# EasyEDA Pro project 工程设计_桌面小屏幕.eprj

# Schematic Schematic1
Board Name: Board1; Create Date: 2024-11-13; Page Name: P1; Project Name: 工程设计_桌面小屏幕; Schematic Name: Schematic1; Update Date: 2025-03-07; Company: 西电; Drawed: 赵怀潼; Page Size: A3; Reviewed: 赵怀潼; Version: V0.1
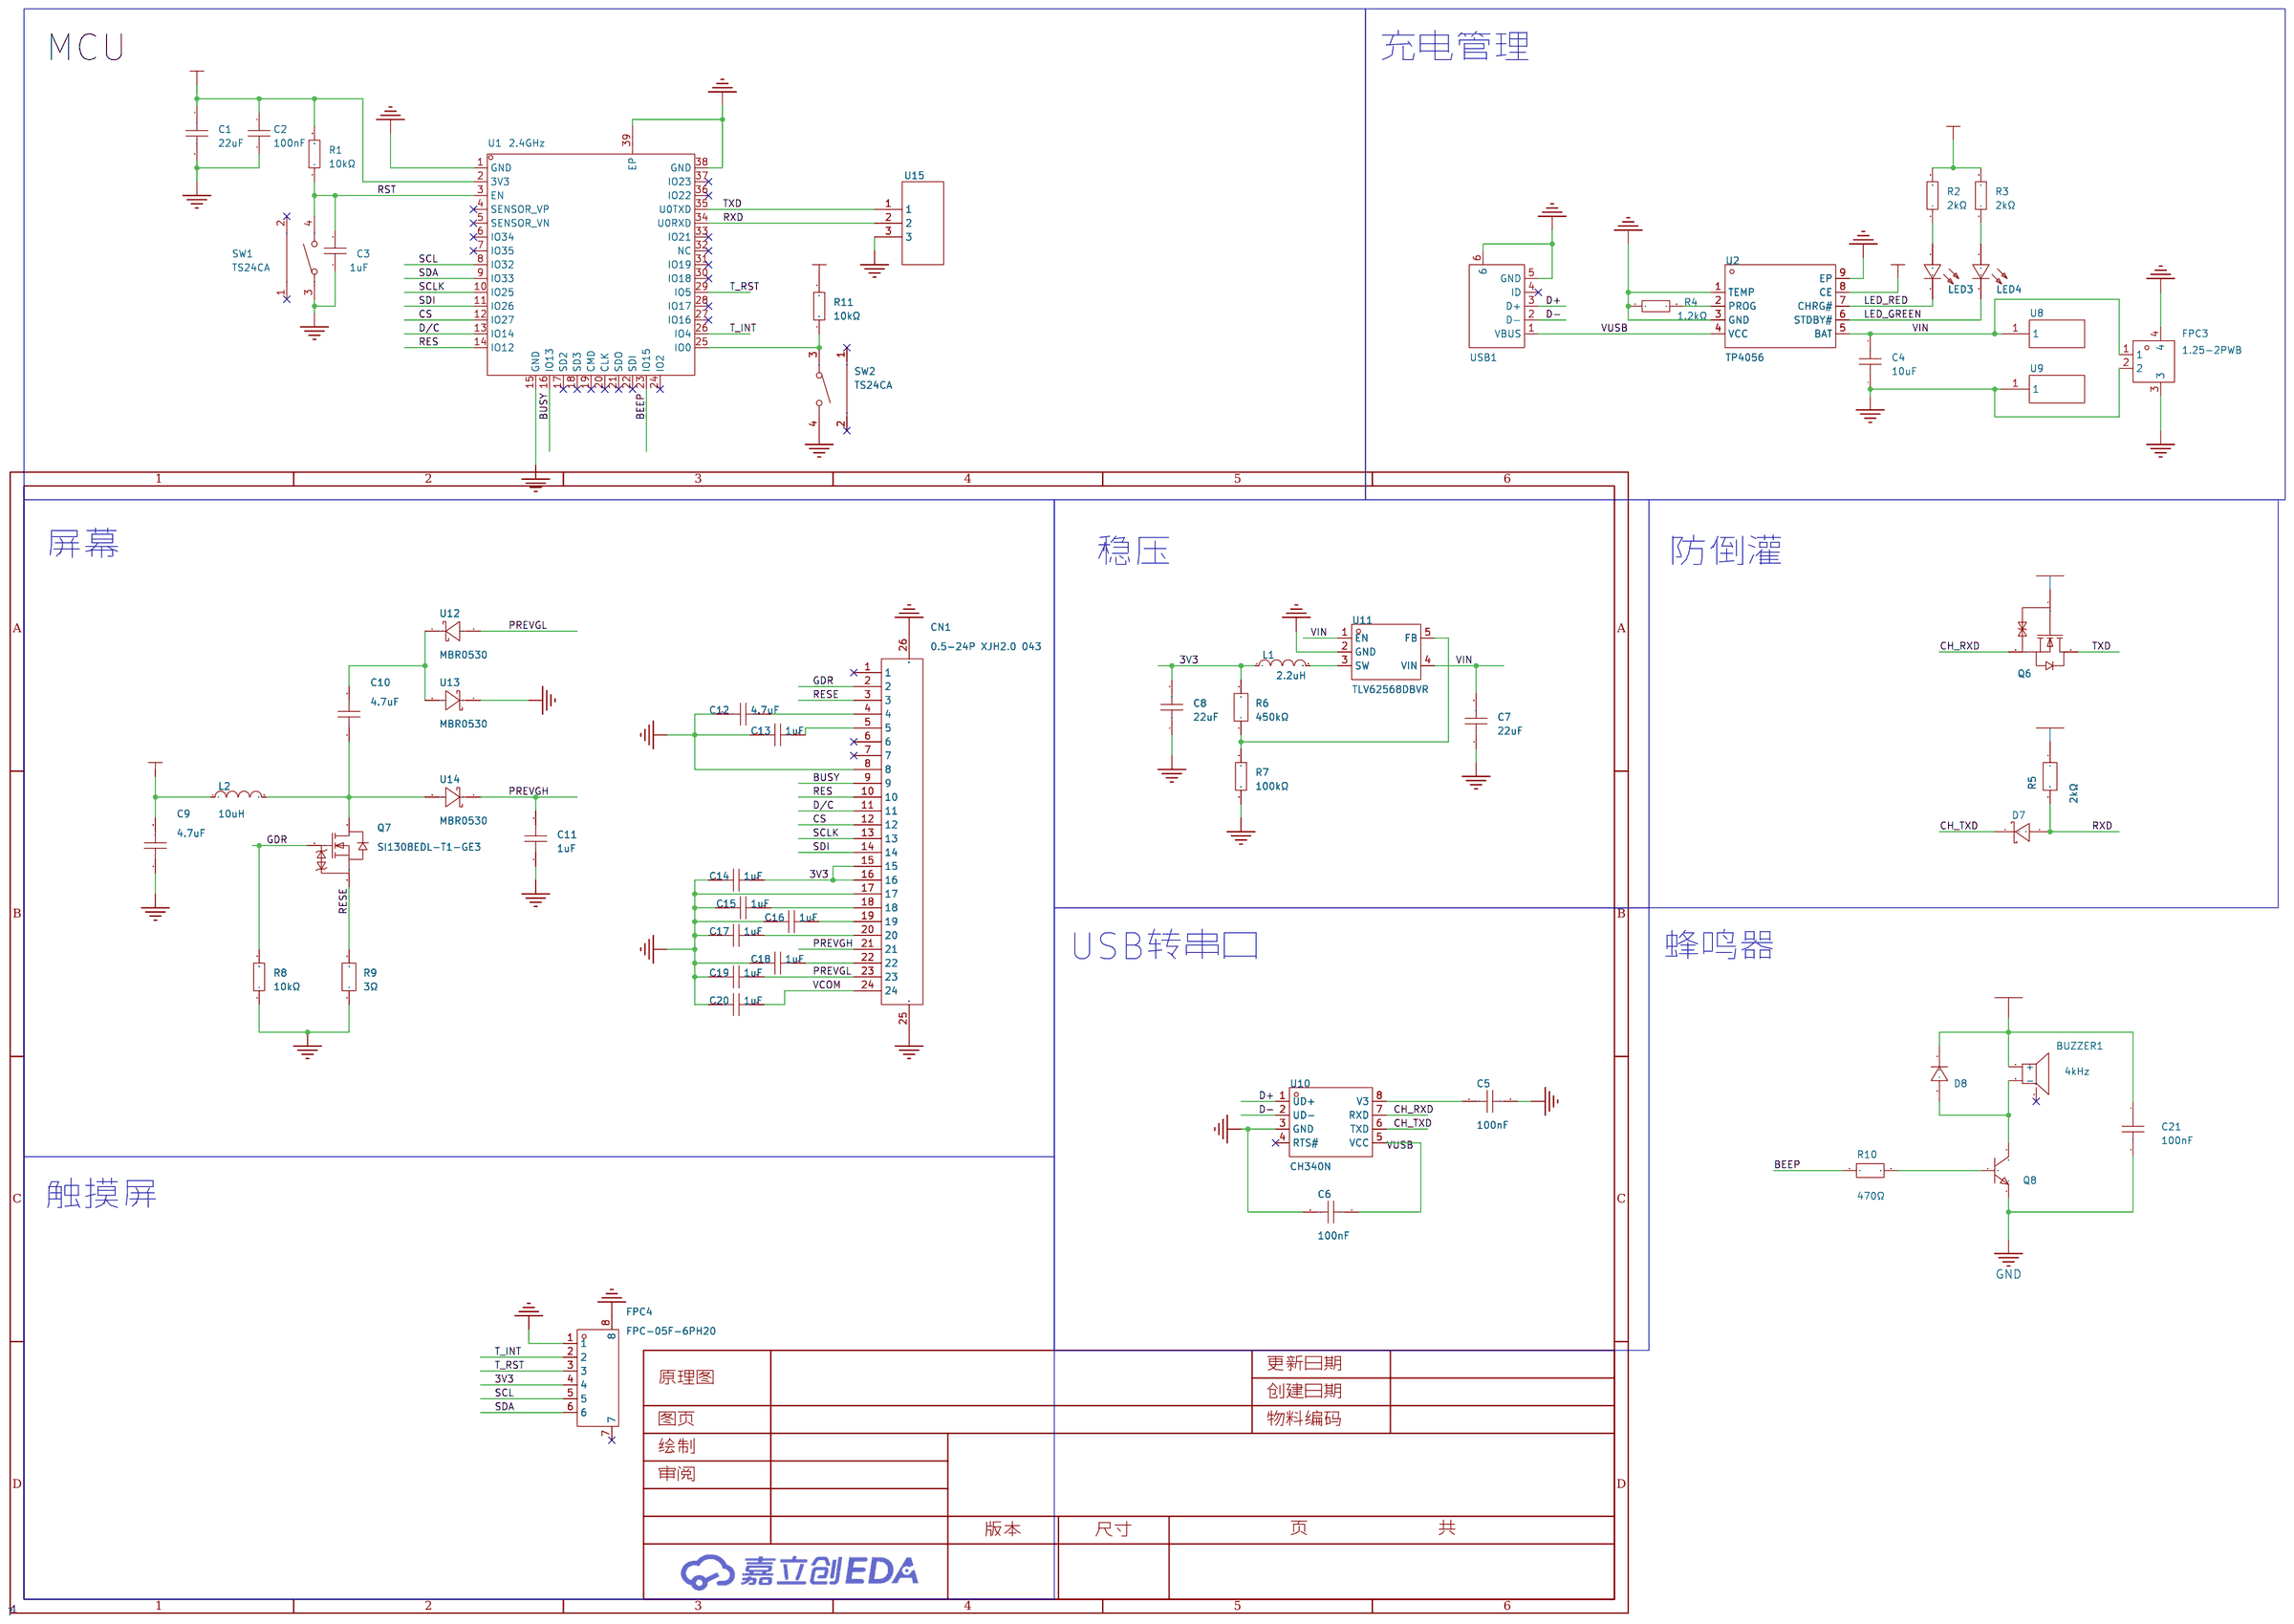
[diagram p0: schematic sheet]

## Parts
BUZZER1  4kHz  [BUZ-SMD_L5.0-W5.5-P4.60]
C1  22uF  [C0603]
C2  100nF  [C0603]
C3  1uF  [C0603]
C4  10uF  [C0603]
C5  100nF  [C0603]
C6  100nF  [C0603]
C7  22uF  [C0603]
C8  22uF  [C0603]
C9  4.7uF  [C0603]
C10  4.7uF  [C0603]
C11  1uF  [C0603]
C12  4.7uF  [C0603]
C13  1uF  [C0603]
C14  1uF  [C0603]
C15  1uF  [C0603]
C16  1uF  [C0603]
C17  1uF  [C0603]
C18  1uF  [C0603]
C19  1uF  [C0603]
C20  1uF  [C0603]
C21  100nF  [C0603]
CN1  0.5-24P XJH2.0 043  [FPC-SMD_24P-P0.50_C5373439]
D7  MBR0520  [SOD-123_L2.7-W1.6-LS3.7-RD-1]
D8  SMMDL914T1G  [SOD-323_L1.8-W1.3-LS2.5-RD]
FPC3  1.25-2PWB  [CONN-SMD_2P-P1.25_DEALON_1.25-2PWB]
FPC4  FPC-05F-6PH20  [FPC-SMD_6P-P0.50_XUNPU_FPC-05F-6PH20]
L1  2.2uH  [IND-SMD_L3.0-W3.0]
L2  10uH  [IND-SMD_L2.0-W1.6]
LED3  NCD0603R1  [LED0603-RD_RED]
LED4  NCD0603R1  [LED0603-RD_RED]
Q6  2SK3018  [SOT-23-3_L2.9-W1.3-P0.95-LS2.4-BR]
Q7  SI1308EDL-T1-GE3  [SOT-323_L2.0-W1.3-P1.30-LS2.1-BR]
Q8  S9013-E  [SOT-23-3_L2.9-W1.3-P1.90-LS2.4-BR]
R1  10kΩ  [R0603]
R2  2kΩ  [R0603]
R3  2kΩ  [R0603]
R4  1.2kΩ  [R0603]
R5  2kΩ  [R0603]
R6  450kΩ  [R0402]
R7  100kΩ  [R0603]
R8  10kΩ  [R0603]
R9  3Ω  [R0603]
R10  470Ω  [R0603]
R11  10kΩ  [R0603]
SW1  TS24CA  [SW-SMD_TS24CA]
SW2  TS24CA  [SW-SMD_TS24CA]
U1  2.4GHz  [WIRELM-SMD_ESP32-S]
U2  TP4056  [ESOP-8_L4.9-W3.9-P1.27-LS6.0-BL-EP]
U8  -  [电池焊接端子封装2]
U9  -  [电池焊接端子封装2]
U10  CH340N  [SOP-8_L4.9-W3.9-P1.27-LS6.0-BL]
U11  TLV62568DBVR  [SOT-23-5_L3.0-W1.7-P0.95-LS2.8-BR]
U12  MBR0530  [SOD-123FL_L2.7-W1.8-LS3.7-RD]
U13  MBR0530  [SOD-123FL_L2.7-W1.8-LS3.7-RD]
U14  MBR0530  [SOD-123FL_L2.7-W1.8-LS3.7-RD]
U15  -  [下载调试点]
USB1  MICRO XNJ ZB  [MICRO-USB-SMD_MICRO-XNJ-ZB]

## Library data of the parts
BUZZER1 = MLT-5020: Supplier Part: C94598; Manufacturer: 华能; Supplier Footprint: SMD,5x5mm; JLCPCB Part Class: Extended Part; Datasheet: https://atta.szlcsc.com/upload/public/pdf/source/20210811/111454390007D221D7259018FB170E62.pdf; Supplier: LCSC; Driver Circuitry: 无源(外部驱动); Technology: 电磁式; Length: 5.2mm; Width: 5.2mm; Height: 2.5mm
C1 = CL10A226MO7JZNC: LCSC Part Name: 22uF ±20% 16V; Supplier Part: C2762594; Manufacturer: SAMSUNG(三星); Supplier Footprint: 0603; JLCPCB Part Class: 扩展库; Datasheet: https://atta.szlcsc.com/upload/public/pdf/source/20220811/0832C3B1C642040B023B7A6186895861.pdf; Supplier: LCSC; Tolerance: ±20%; Voltage Rated: 16V; Temperature Coefficient: X5R
C2 C21 = CGA0603X7R104K500JT: LCSC Part Name: 100nF ±10% 50V; Supplier Part: C6119867; Manufacturer: HRE(芯声); Supplier Footprint: 0603; JLCPCB Part Class: Extended Part; Supplier: LCSC; Tolerance: ±10%; Voltage Rated: 50V; Temperature Coefficient: X7R
C3 = CL10A105KB8NNNC: LCSC Part Name: 1uF ±10% 50V; Supplier Part: C15849; Manufacturer: SAMSUNG(三星); Supplier Footprint: 0603; JLCPCB Part Class: Basic Part; Datasheet: https://atta.szlcsc.com/upload/public/pdf/source/20160218/1457707763339.pdf; Supplier: LCSC; Tolerance: ±10%; Voltage Rated: 50V; Temperature Coefficient: X5R
C4 = CL10A106KP8NNNC: LCSC Part Name: 10uF ±10% 10V; Supplier Part: C19702; Manufacturer: SAMSUNG(三星); Supplier Footprint: 0603; JLCPCB Part Class: Basic Part; Datasheet: https://atta.szlcsc.com/upload/public/pdf/source/20160218/1457707763339.pdf; Supplier: LCSC; Tolerance: ±10%; Voltage Rated: 10V; Temperature Coefficient: X5R
C5 C6 = CGA0603X7R104K500JT: LCSC Part Name: 100nF ±10% 50V; Supplier Part: C6119867; Manufacturer: HRE(芯声); Supplier Footprint: 0603; JLCPCB Part Class: 扩展库; Supplier: LCSC; Tolerance: ±10%; Voltage Rated: 50V; Temperature Coefficient: X7R
C7 C8 = CL10A226MO7JZNC: LCSC Part Name: 22uF ±20% 16V; Supplier Part: C2762594; Manufacturer: SAMSUNG(三星); Supplier Footprint: 0603; JLCPCB Part Class: Extended Part; Datasheet: https://atta.szlcsc.com/upload/public/pdf/source/20220811/0832C3B1C642040B023B7A6186895861.pdf; Supplier: LCSC; Tolerance: ±20%; Voltage Rated: 16V; Temperature Coefficient: X5R
C9 C10 C12 = GRM188R6YA475KE15D: LCSC Part Name: 4.7uF ±10% 35V; Supplier Part: C162274; Manufacturer: muRata(村田); Supplier Footprint: 0603; JLCPCB Part Class: 扩展库; Datasheet: https://atta.szlcsc.com/upload/public/pdf/source/20200305/C490387_23319AE8C154DEB24C505E6C82A8106A.pdf; Supplier: LCSC; Tolerance: ±10%; Voltage Rated: 35V; Temperature Coefficient: X5R
C11 C13-C20 = CL10A105KB8NNNC: LCSC Part Name: 1uF ±10% 50V; Supplier Part: C15849; Manufacturer: SAMSUNG(三星); Supplier Footprint: 0603; JLCPCB Part Class: 基础库; Datasheet: https://atta.szlcsc.com/upload/public/pdf/source/20160218/1457707763339.pdf; Supplier: LCSC; Tolerance: ±10%; Voltage Rated: 50V; Temperature Coefficient: X5R
CN1 = 0.5-24P XJH2.0 043: LCSC Part Name: 翻盖式 下接 P数:24P 间距:0.5mm; Supplier Part: C5373439; Manufacturer: SHOU HAN(首韩); Supplier Footprint: SMD,P=0.5mm,卧贴; JLCPCB Part Class: Extended Part; Datasheet: https://atta.szlcsc.com/upload/public/pdf/source/20230321/6563F7605BD8F709B31468F177A05454.pdf; Supplier: LCSC; Locking Feature: 翻盖式; Contact Type: 下接; Number of Contacts: 24P; Pitch: 0.5mm; Mounting Type: 卧贴; FFC, FCB Thickness: 0.3mm; Height Above Board: 2mm; Contact Material: 黄铜; Contact Plating: 锡; Operating Temperature Range: -55℃~+85℃
D7 = MBR0520_C699111: LCSC Part Name: 电压:20V 电流:500mA; Supplier Part: C699111; Manufacturer: YANGJIE(扬杰); Supplier Footprint: SOD-123; JLCPCB Part Class: Extended Part; Datasheet: https://atta.szlcsc.com/upload/public/pdf/source/20200709/C699108_94C8F1A54679DD603C9696C8694A3BC2.pdf; Supplier: LCSC; Forward Voltage (Vf@If): 450mV@500mA; Reverse Voltage (Vr): 20V; Rectified Current: 500mA; Reverse Leakage Current (Ir): 200uA@20V
D8 = SMMDL914T1G: LCSC Part Name: 电压:100V 电流:200mA; Supplier Part: C294609; Manufacturer: onsemi(安森美); Supplier Footprint: SOD-323; JLCPCB Part Class: Extended Part; Datasheet: https://atta.szlcsc.com/upload/public/pdf/source/20180918/C294609_F0BDFE39D0BEF637F2662C3D53E3FABD.pdf; Supplier: LCSC; Diode Configuration: 独立式; Forward Voltage (Vf@If): 1V@10mA; Reverse Voltage (Vr): 100V; Average Rectified Current (Io): 200mA; Power Dissipation: 200mW; Reverse Leakage Current: 5uA@75V; Reverse Recovery Time (trr): 4ns; Operating Temperature: -55℃~+150℃@(Tj)
FPC3 = 1.25-2PWB: 参考系列:-;间距:1.25mm;插针结构:1x2P;排数:1;每排PIN数:2;行距:-;公母:公型插针;安装方式:卧贴;额定电流:-;工作温度范围:-40~+85;; LCSC Part Name: 1.25mm 1x2P 卧贴; Supplier Part: C2905009; Manufacturer: DEALON(德艺隆); Supplier Footprint: SMD,P=1.25mm; JLCPCB Part Class: 扩展库; Datasheet: https://atta.szlcsc.com/upload/public/pdf/source/20211025/32B11FCE5054D08D2841E43E3DE676AA.pdf; Supplier: LCSC; Pitch: 1.25mm; Pins Structure: 1x2P; Number of Rows: 1; Number of PINs Per Row: 2; Gender: 公型插针; Mounting Style: 卧贴; Operating Temperature Range: -40~+85
FPC4 = FPC-05F-6PH20: LCSC Part Name: 间距:0.5mm P数:6P 翻盖式 下接; Supplier Part: C2856796; Manufacturer: XUNPU(讯普); Supplier Footprint: SMD,P=0.5mm,卧贴; JLCPCB Part Class: 扩展库; Datasheet: https://atta.szlcsc.com/upload/public/pdf/source/20210922/16B003FB53336DDF6538142CC465AC4D.pdf; Supplier: LCSC; Locking Feature: 翻盖式; Contact Type: 下接; Number of Contacts: 6P; Pitch: 0.5mm; Mounting Type: 卧贴; FFC, FCB Thickness: 0.3mm; Height Above Board: 2mm; Operating Temperature Range: -25℃~+85℃
L1 = SWPA3015S2R2MT: LCSC Part Name: 2.2uH ±20%; Supplier Part: C43389; Manufacturer: Sunlord(顺络); Supplier Footprint: SMD; JLCPCB Part Class: Extended Part; Datasheet: https://atta.szlcsc.com/upload/public/pdf/source/20231024/317626D2AA2F8AB4113C1875E432E6E1.pdf; Supplier: LCSC; Tolerance: ±20%; Rated Current: 2A
L2 = WPN201610H100MT: LCSC Part Name: 10uH ±20% 800mA; Supplier Part: C89132; Manufacturer: Sunlord(顺络); Supplier Footprint: 0806; JLCPCB Part Class: 扩展库; Datasheet: https://atta.szlcsc.com/upload/public/pdf/source/20231024/AA72387348CB63159A6CBE41DDE5ECDA.pdf; Supplier: LCSC; Tolerance: ±20%; Rated Current: 650mA; Current - Saturation(Isat): 800mA; DC Resistance(DCR): 826mΩ
LED3 LED4 = NCD0603R1_C84263: Supplier Part: C84263; Manufacturer: 国星光电; Supplier Footprint: 0603; JLCPCB Part Class: Extended Part; Datasheet: https://atta.szlcsc.com/upload/public/pdf/source/20200820/C84263_DABC6A75E58F576973B407FDBA283D60.pdf; Supplier: LCSC; Emitted Color: 红色; Forward Voltage (VF): 1.6V~2.6V; Power Dissipation: 65mW; Forward Current: 20mA; Dominant Wavelength: 615nm~630nm; Diode Configuration: 独立二极管; Lens Color: 无色透明透镜; Luminous Intensity: 80mcd~220mcd; Viewing Angle: 130°; Operating Temperature: -30℃~+85℃
Q6 = 2SK3018_C20069148: LCSC Part Name: 1个N沟道 耐压:30V 电流:100mA; Supplier Part: C20069148; Manufacturer: 宏迦橙; Supplier Footprint: SOT-23; JLCPCB Part Class: Extended Part; Datasheet: https://atta.szlcsc.com/upload/public/pdf/source/20240111/1590F7A8CAEE9F6D3F3F2A55915357D5.pdf; Supplier: LCSC; Type: 1个N沟道; Drain Source Voltage (Vdss): 30V; Continuous Drain Current (Id): 100mA; Drain Source On Resistance (RDS(on)@Vgs,Id): 8Ω@4.0V,10mA; Power Dissipation (Pd): 200mW; Gate Threshold Voltage (Vgs(th)@Id): 1.5V; Input Capacitance (Ciss@Vds): 13pF; Reverse Transfer Capacitance (Crss@Vds): 4pF; Operating Temperature: -55℃~+150℃
Q7 = SI1308EDL-T1-GE3: LCSC Part Name: 1个N沟道 耐压:30V 电流:1.5A; Supplier Part: C469327; Manufacturer: VISHAY(威世); Supplier Footprint: SOT-323; JLCPCB Part Class: 扩展库; Datasheet: https://atta.szlcsc.com/upload/public/pdf/source/20191217/C469327_3FE8BCBB7604A1B1F6779A1D9DD725BB.pdf; Supplier: LCSC; Type: 1个N沟道; Drain Source Voltage (Vdss): 30V; Continuous Drain Current (Id): 1.5A; Drain Source On Resistance (RDS(on)@Vgs,Id): 132mΩ@10V,1.4A; Power Dissipation (Pd): 400mW; Gate Threshold Voltage (Vgs(th)@Id): 1.5V@250uA; Total Gate Charge (Qg@Vgs): 1.4nC@10V; Input Capacitance (Ciss@Vds): 105pF@15V; Reverse Transfer Capacitance (Crss@Vds): 11pF@15V; Operating Temperature: -55℃~+150℃
Q8 = S9013-E: LCSC Part Name: NPN 电流:500mA 耐压:25V; Supplier Part: C41371419; Manufacturer: MDD(辰达半导体); Supplier Footprint: SOT-23; JLCPCB Part Class: Extended Part; Datasheet: https://atta.szlcsc.com/upload/public/pdf/source/20241113/4DDBD2B8A7B6A974495B9B970C95E559.pdf; Supplier: LCSC; Transistor Type: NPN; Collector Current (Ic): 500mA; Collector-Emitter Breakdown Voltage (Vceo): 25V; Power Dissipation (Pd): 300mW; DC Current Gain (hFE@Ic,Vce): 120@50mA,1V; Transition Frequency (fT): 150MHz; Collector Cut-Off Current (Icbo): 100nA; Collector-Emitter Saturation Voltage (VCE(sat)@Ic,Ib): 600mV@500mA,50mA; Operating Temperature: -55℃~+150℃
R1 R8 R11 = 0603WAF1002T5E: LCSC Part Name: 厚膜电阻 10kΩ ±1% 100mW; Supplier Part: C25804; Manufacturer: UNI-ROYAL(厚声); Supplier Footprint: 0603; JLCPCB Part Class: 基础库; Datasheet: https://atta.szlcsc.com/upload/public/pdf/source/20200306/C422600_1E6D84923E4A46A82E41ADD87F860B5C.pdf; Supplier: LCSC; Type: 厚膜电阻; Tolerance: ±1%; Power(Watts): 100mW; Overload Voltage (Max): 75V; Temperature Coefficient: ±100ppm/℃; Operating Temperature Range: -55℃~+155℃
R2 R3 = 0603WAF2001T5E: LCSC Part Name: 2kΩ ±1% 100mW 厚膜电阻; Supplier Part: C22975; Manufacturer: UNI-ROYAL(厚声); Supplier Footprint: 0603; JLCPCB Part Class: 基础库; Datasheet: https://atta.szlcsc.com/upload/public/pdf/source/20200306/C422600_1E6D84923E4A46A82E41ADD87F860B5C.pdf; Supplier: LCSC; Type: 厚膜电阻; Tolerance: ±1%; Power(Watts): 100mW; Overload Voltage (Max): 75V; Temperature Coefficient: ±100ppm/℃; Operating Temperature Range: -55℃~+155℃
R4 = 0603WAF1201T5E: LCSC Part Name: 1.2kΩ ±1% 100mW 厚膜电阻; Supplier Part: C22765; Manufacturer: UNI-ROYAL(厚声); Supplier Footprint: 0603; JLCPCB Part Class: 基础库; Datasheet: https://atta.szlcsc.com/upload/public/pdf/source/20200306/C422600_1E6D84923E4A46A82E41ADD87F860B5C.pdf; Supplier: LCSC; Type: 厚膜电阻; Tolerance: ±1%; Power(Watts): 100mW; Overload Voltage (Max): 75V; Temperature Coefficient: ±100ppm/℃; Operating Temperature Range: -55℃~+155℃
R5 = 0603WAF2001T5E: LCSC Part Name: 2kΩ ±1% 100mW 厚膜电阻; Supplier Part: C22975; Manufacturer: UNI-ROYAL(厚声); Supplier Footprint: 0603; JLCPCB Part Class: Basic Part; Datasheet: https://atta.szlcsc.com/upload/public/pdf/source/20200306/C422600_1E6D84923E4A46A82E41ADD87F860B5C.pdf; Supplier: LCSC; Type: 厚膜电阻; Tolerance: ±1%; Power(Watts): 100mW; Overload Voltage (Max): 75V; Temperature Coefficient: ±100ppm/℃; Operating Temperature Range: -55℃~+155℃
R6 = FRC0402F4503TS: LCSC Part Name: 450kΩ ±1% 62.5mW 厚膜电阻; Supplier Part: C5159688; Manufacturer: FOJAN(富捷); Supplier Footprint: 0402; JLCPCB Part Class: 扩展库; Datasheet: https://atta.szlcsc.com/upload/public/pdf/source/20211221/925EC7D7225764EE0046F22065062C87.pdf; Supplier: LCSC; Type: 厚膜电阻; Tolerance: ±1%; Power(Watts): 62.5mW; Overload Voltage (Max): 50V; Temperature Coefficient: ±100ppm/℃
R7 = 0603WAF1003T5E: LCSC Part Name: 100kΩ ±1% 100mW 厚膜电阻; Supplier Part: C25803; Manufacturer: UNI-ROYAL(厚声); Supplier Footprint: 0603; JLCPCB Part Class: 基础库; Datasheet: https://atta.szlcsc.com/upload/public/pdf/source/20200306/C422600_1E6D84923E4A46A82E41ADD87F860B5C.pdf; Supplier: LCSC; Type: 厚膜电阻; Tolerance: ±1%; Power(Watts): 100mW; Overload Voltage (Max): 75V; Temperature Coefficient: ±100ppm/℃; Operating Temperature Range: -55℃~+155℃
R9 = RCA033RFLF: LCSC Part Name: 3Ω ±1% 100mW; Supplier Part: C22356394; Manufacturer: HKR(香港电阻); Supplier Footprint: 0603; JLCPCB Part Class: 扩展库; Datasheet: https://atta.szlcsc.com/upload/public/pdf/source/20240312/EB29F8B3E9AD4CE07E65E9956C47F4F5.pdf; Supplier: LCSC; Tolerance: ±1%; Power(Watts): 100mW
R10 = 0603WAF4700T5E: LCSC Part Name: 470Ω ±1% 100mW 厚膜电阻; Supplier Part: C23179; Manufacturer: UNI-ROYAL(厚声); Supplier Footprint: 0603; JLCPCB Part Class: Basic Part; Datasheet: https://atta.szlcsc.com/upload/public/pdf/source/20200306/C422600_1E6D84923E4A46A82E41ADD87F860B5C.pdf; Supplier: LCSC; Type: 厚膜电阻; Tolerance: ±1%; Power(Watts): 100mW; Overload Voltage (Max): 75V; Temperature Coefficient: ±100ppm/℃; Operating Temperature Range: -55℃~+155℃
SW1 SW2 = TS24CA: LCSC Part Name: 4.55*1.8*3.5mm 卧贴 轻触开关; Supplier Part: C393942; Manufacturer: SHOU HAN(首韩); Supplier Footprint: SMD; JLCPCB Part Class: 扩展库; Datasheet: https://atta.szlcsc.com/upload/public/pdf/source/20190521/C393942_591A9E318887EFA4274D34029981AD99.pdf; Supplier: LCSC; Circuit: 单刀单掷; Actuator Style: 矩形按钮; Mounting Style: 卧贴; Switch Length: 4.55mm; Switch Width: 1.8mm; Switch Height: 3.5mm; Contact Current: 50mA; Voltage Rating (DC): 12V
U1 = ESP32-S: Supplier Part: C277944; Manufacturer: Ai-Thinker(安信可); Supplier Footprint: SMD; JLCPCB Part Class: 扩展库; Datasheet: https://atta.szlcsc.com/upload/public/pdf/source/20211217/F4BEA33E732D6002D10DAED85BBCB52B.pdf; Supplier: LCSC; Core Processor: ESP32芯片; Support Interface: I2C；UART；DAC；SPI；PWM；ADC; Antenna Type: IPEX接口; Output Power: 17dBm; Operating Voltage: 3.3V; Sensitivity: -90dBm; Operating Temperature: -40℃~+85℃
U2 = TP4056_C382139: LCSC Part Name: 1A锂电池充电IC; Supplier Part: C382139; Manufacturer: TPOWER(天源); Supplier Footprint: ESOP-8; JLCPCB Part Class: Extended Part; Datasheet: https://atta.szlcsc.com/upload/public/pdf/source/20190327/C382139_EC85960E6FE3E26856C240C81751A184.pdf; Supplier: LCSC; The Chip Type: 线性充电芯片; Supply Voltage: 4V~6V; Maximum Charge Current: 1A; Charging Saturation Voltage: 4.2V; Type of Battery: 锂离子/聚合物; Number of Cells: 1; Operating Temperature: -40℃~+85℃
U8 U9 = 电池焊接端子2: Check: false
U10 = CH340N: LCSC Part Name: USB转串口芯片CH340; Supplier Part: C2977777; Manufacturer: WCH(南京沁恒); Supplier Footprint: SOP-8; JLCPCB Part Class: 扩展库; Datasheet: https://atta.szlcsc.com/upload/public/pdf/source/20240313/115CDE92081B1D6CB446704AD5D0F5F2.pdf; Supplier: LCSC; Applications Function: USB转串口; Protocol: USB 2.0; Number of Channels: 1; Supply Voltage: 3.3V；5V; Data Rate: 2Mbps; Operating Temperature: -20℃~+70℃
U11 = TLV62568DBVR: LCSC Part Name: 1A高效同步降压转换器; Supplier Part: C163219; Manufacturer: TI(德州仪器); Supplier Footprint: SOT-23-5; JLCPCB Part Class: 扩展库; Datasheet: https://www.ti.com/cn/lit/gpn/tlv62568; Supplier: LCSC; Function: 降压型; Output Type: 可调; Input Voltage: 2.5V~5.5V; Output Voltage: 600mV~5.5V; Output Current: 1A; Switching Frequency: 1.5MHz; Operating Temperature: -40℃~+125℃@(TJ); Synchronous Rectification: 是; Number of Outputs: 1; Topology: 降压式; Switch tube (built-in/external): 内置
U12-U14 = MBR0530: LCSC Part Name: 电压:30V 电流:500mA; Supplier Part: C2983233; Manufacturer: LGE(鲁光); Supplier Footprint: SOD-123FL; JLCPCB Part Class: Extended Part; Datasheet: https://atta.szlcsc.com/upload/public/pdf/source/20220321/9742F6F1F47CB99E120BB448A03A77A7.pdf; Supplier: LCSC; Diode Configuration: 独立式; Forward Voltage (Vf@If): 550mV@500mA; Reverse Voltage (Vr): 30V; Rectified Current: 500mA; Reverse Leakage Current (Ir): 20uA@30V
U15 = 下载调试点: Check: false
USB1 = MICRO XNJ ZB: LCSC Part Name: Micro-B 母 卧贴; Supplier Part: C668587; Manufacturer: SHOU HAN(首韩); Supplier Footprint: SMD; JLCPCB Part Class: Extended Part; Datasheet: https://atta.szlcsc.com/upload/public/pdf/source/20220415/B539C0029259EFDC9C3C32CC0240BFFF.pdf; Supplier: LCSC; Connector Type: Micro-B; Standard: USB 2.0; Gender: 母; Mounting Style: 卧贴; Number of Contacts: 5P; Number of Ports: 1; Current Rating - Power (Max): 1.8A; Rated Voltage (Max): 30V; Connect-Disconnect Life: 5千次; Core Colour: 黑色; Operating Temperature Range: -30℃~+80℃

## Nets
3V3: BUZZER1.2(+) C1.1 C2.2 C8.2 C9.2 C14.1 C21.1 CN1.15 CN1.16 D8.1(C) FPC4.4 L1.1 L2.1 Q6.1(G) R1.2 R5.1 R6.2 R11.2 U1.2(3V3)
GND: C1.2 C2.1 C3.1 C4.1 C5.2 C6.2 C7.1 C8.1 C9.1 C11.1 C12.2 C13.2 C14.2 C15.2 C16.2 C17.2 C18.2 C19.2 C20.2 C21.2 CN1.8 CN1.17 CN1.25 CN1.26 FPC3.2 FPC3.3 FPC3.4 FPC4.1 FPC4.8 Q8.2(E) R4.1 R7.1 R8.1 R9.1 SW1.3 SW2.4 U1.1(GND) U1.15(GND) U1.38(GND) U1.39(EP) U2.1(TEMP) U2.3(GND) U2.9(EP) U9.1 U10.3(GND) U11.2(GND) U13.1(K) U15.3 USB1.5(GND) USB1.6
VIN: C4.2 C7.2 FPC3.1 U2.5(BAT) U8.1 U11.1(EN) U11.4(VIN)
BEEP: R10.1 U1.23(IO15)
BUSY: CN1.9 U1.16(IO13)
CH_RXD: Q6.2(S) U10.7(RXD)
CH_TXD: D7.1(K) U10.6(TXD)
CS: CN1.12 U1.12(IO27)
D+: U10.1(UD+) USB1.3(D+)
D-: U10.2(UD-) USB1.2(D-)
D/C: CN1.11 U1.13(IO14)
GDR: CN1.2 Q7.1(G) R8.2
LED_GREEN: LED4.2(K) U2.6(STDBY#)
LED_RED: LED3.2(K) U2.7(CHRG#)
PREVGH: C11.2 CN1.21 U14.1(K)
PREVGL: C19.1 CN1.23 U12.2(A)
RES: CN1.10 U1.14(IO12)
RESE: CN1.3 Q7.2(S) R9.2
RST: C3.2 R1.1 SW1.4 U1.3(EN)
RXD: D7.2(A) R5.2 U1.34(U0RXD) U15.2
SCL: FPC4.5 U1.8(IO32)
SCLK: CN1.13 U1.10(IO25)
SDA: FPC4.6 U1.9(IO33)
SDI: CN1.14 U1.11(IO26)
T_INT: FPC4.2 U1.26(IO4)
T_RST: FPC4.3 U1.29(IO5)
TXD: Q6.3(D) U1.35(U0TXD) U15.1
VCOM: C20.1 CN1.24
VUSB: C6.1 R2.2 R3.2 U2.4(VCC) U2.8(CE) U10.5(VCC) USB1.1(VBUS)
$1N3910: LED3.1(A) R2.1
$1N3919: LED4.1(A) R3.1
$1N3995: R4.2 U2.2(PROG)
$1N6109: C5.1 U10.8(V3)
$1N6898: L1.2 U11.3(SW)
$1N7140: R6.1 R7.2 U11.5(FB)
$1N8601: C10.1 L2.2 Q7.3(D) U14.2(A)
$1N8997: C10.2 U12.1(K) U13.2(A)
$1N10559: C12.1 CN1.4
$1N10610: C13.1 CN1.5
$1N10807: C15.1 CN1.18
$1N10858: C16.1 CN1.19
$1N10911: C17.1 CN1.20
$1N10977: C18.1 CN1.22
$1N13203: BUZZER1.3(-) D8.2(A) Q8.3(C)
$1N13207: Q8.1(B) R10.2
Net-(R11-1): R11.1 SW2.3 U1.25(IO0)

Not connected (* = marked no-connect by the designer): BUZZER1 1(NC)*; CN1 1* 6* 7*; FPC4 7*; SW1 1* 2*; SW2 1* 2*; U1 4(SENSOR_VP)* 5(SENSOR_VN)* 6(IO34)* 7(IO35)* 17(SD2)* 18(SD3)* 19(CMD)* 20(CLK)* 21(SDO)* 22(SDI)* 24(IO2)* 27(IO16)* 28(IO17)* 30(IO18)* 31(IO19)* 32(NC)* 33(IO21)* 36(IO22)* 37(IO23)*; U10 4(RTS#)*; USB1 4(ID)*

## Notes on the sheet
- MCU
- 充电管理
- 屏幕
- 稳压
- 防倒灌
- USB转串口
- 蜂鸣器
- 触摸屏

# Board PCB1
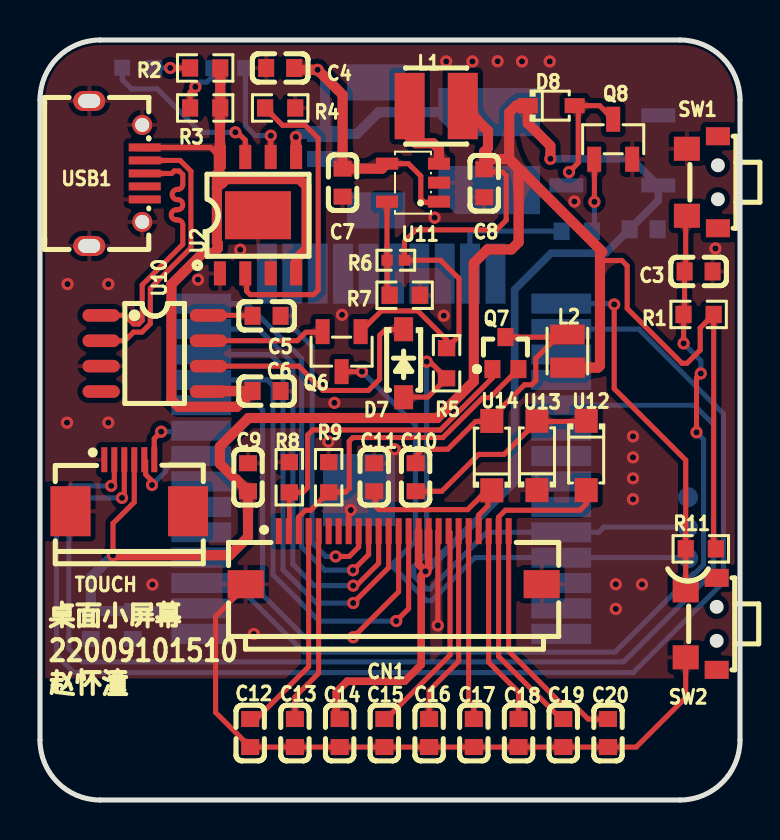
[diagram p1: board, top side]
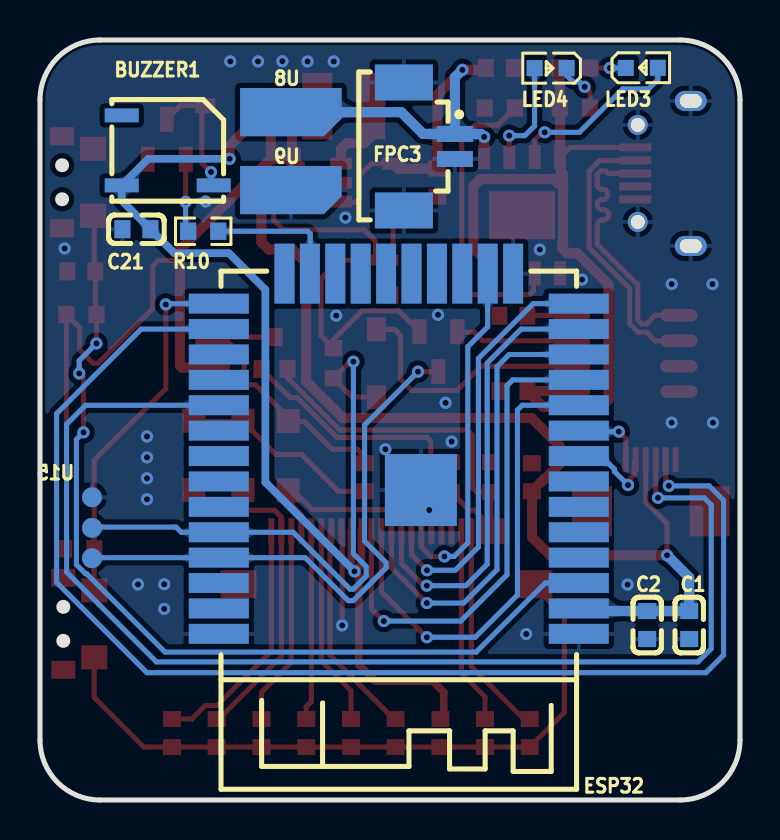
[diagram p2: board, bottom side, seen from below]

Outline 35 x 38 mm; copper layers: Top Layer, Bottom Layer. Coordinates in mm from the lower left corner of the outline.
Outline path: 0,35 0,3 arc(0.88,0.88) 3,0 32,0 arc(34.12,0.88) 35,3 35,35 arc(34.12,37.12) 32,38 3,38 arc(0.88,37.12) 0,35
Stack: Top Layer 0.035mm / Dielectric1 1.51mm FR4 er 4.5 / Bottom Layer 0.035mm

## Design rules (mm)
net D-: DP1
net D+: DP1
template: JLCPCB Capability(Two Layers Board)
spacing copperThickness1oz (default): track to track 0.102, other pairs 0.152 to 0.3
spacing copperThickness2oz: track to track 0.203, other pairs 0.152 to 0.3
track width copperThickness1oz (default): min 0.127, default 0.254, max 2.54
track width copperThickness2oz: min 0.203, default 0.254, max 2.54
differential pair differentialPair (default): width min 0.127, default 0.254, max 2.54; gap min 0.152, default 0.152
via viaSize (default): diameter min 0.5, default 0.61, max 10; hole min 0.3, default 0.305, max 6.3

## Placement (name value [footprint] x y rotation side)
BUZZER1  4kHz  [BUZ-SMD_L5.0-W5.5-P4.60]  28.61 32.48 180 bottom
C1  22uF  [C0603]  2.54 8.75 270 bottom
C2  100nF  [C0603]  4.64 8.75 90 bottom
C3  1uF  [C0603]  32.93 26.43 180 top
C4  10uF  [C0603]  12.01 36.6 0 top
C5  100nF  [C0603]  11.33 24.21 0 top
C6  100nF  [C0603]  11.33 20.45 0 top
C7  22uF  [C0603]  15.13 30.87 90 top
C8  22uF  [C0603]  22.21 30.84 90 top
C9  4.7uF  [C0603]  10.4 16.14 270 top
C10  4.7uF  [C0603]  18.78 16.14 270 top
C11  1uF  [C0603]  16.71 16.14 270 top
C12  4.7uF  [C0603]  10.51 3.35 270 top
C13  1uF  [C0603]  12.75 3.35 270 top
C14  1uF  [C0603]  14.98 3.35 270 top
C15  1uF  [C0603]  17.22 3.35 270 top
C16  1uF  [C0603]  19.46 3.35 270 top
C17  1uF  [C0603]  21.69 3.35 270 top
C18  1uF  [C0603]  23.93 3.35 270 top
C19  1uF  [C0603]  26.16 3.35 270 top
C20  1uF  [C0603]  28.4 3.35 270 top
C21  100nF  [C0603]  30.18 28.54 0 bottom
CN1  0.5-24P XJH2.0 043  [FPC-SMD_24P-P0.50_C5373439]  17.68 12.12 0 top
D7  MBR0520  [SOD-123_L2.7-W1.6-LS3.7-RD-1]  18.18 21.84 270 top
D8  SMMDL914T1G  [SOD-323_L1.8-W1.3-LS2.5-RD]  25.56 34.72 0 top
ESP32  2.4GHz  [WIRELM-SMD_ESP32-S]  17.06 17.31 0 bottom
FPC3  1.25-2PWB  [CONN-SMD_2P-P1.25_DEALON_1.25-2PWB]  15.53 32.68 270 bottom
L1  2.2uH  [IND-SMD_L3.0-W3.0]  19.81 34.7 0 top
L2  10uH  [IND-SMD_L2.0-W1.6]  26.37 22.45 270 top
LED3  NCD0603R1  [LED0603-RD_RED]  4.91 36.61 180 bottom
LED4  NCD0603R1  [LED0603-RD_RED]  9.47 36.6 0 bottom
Q6  2SK3018  [SOT-23-3_L2.9-W1.3-P0.95-LS2.4-BR]  15.08 22.42 90 top
Q7  SI1308EDL-T1-GE3  [SOT-323_L2.0-W1.3-P1.30-LS2.1-BR]  23.27 22.34 270 top
Q8  S9013-E  [SOT-23-3_L2.9-W1.3-P1.90-LS2.4-BR]  28.66 33.04 270 top
R1  10kΩ  [R0603]  32.93 24.28 0 top
R2  2kΩ  [R0603]  8.26 36.6 0 top
R3  2kΩ  [R0603]  8.26 34.6 0 top
R4  1.2kΩ  [R0603]  12.01 34.6 180 top
R5  2kΩ  [R0603]  20.33 21.84 270 top
R6  450kΩ  [R0402]  17.79 26.99 0 top
R7  100kΩ  [R0603]  18.23 25.24 180 top
R8  10kΩ  [R0603]  12.47 16.14 270 top
R9  3Ω  [R0603]  14.43 16.14 270 top
R10  470Ω  [R0603]  26.84 28.44 0 bottom
R11  10kΩ  [R0603]  33.04 12.56 0 top
SW1  TS24CA  [SW-SMD_TS24CA]  33.12 30.89 270 top
SW2  TS24CA  [SW-SMD_TS24CA]  33.06 8.81 270 top
TOUCH  FPC-05F-6PH20  [FPC-SMD_6P-P0.50_XUNPU_FPC-05F-6PH20]  4.46 15.73 0 top
U2  TP4056  [ESOP-8_L4.9-W3.9-P1.27-LS6.0-BL-EP]  10.9 29.24 0 top
U8  -  [电池焊接端子封装2]  19.92 31.92 0 top
U9  -  [电池焊接端子封装2]  19.92 28.02 0 top
U10  CH340N  [SOP-8_L4.9-W3.9-P1.27-LS6.0-BL]  5.74 22.33 270 top
U11  TLV62568DBVR  [SOT-23-5_L3.0-W1.7-P0.95-LS2.8-BR]  18.65 30.87 0 top
U12  MBR0530  [SOD-123FL_L2.7-W1.8-LS3.7-RD]  27.31 17.23 270 top
U13  MBR0530  [SOD-123FL_L2.7-W1.8-LS3.7-RD]  24.85 17.23 90 top
U14  MBR0530  [SOD-123FL_L2.7-W1.8-LS3.7-RD]  22.59 17.22 90 top
U15  -  [下载调试点]  32.4 12.6 180 top
USB1  MICRO XNJ ZB  [MICRO-USB-SMD_MICRO-XNJ-ZB]  3.85 31.33 90 top

## Footprints (pads in the part's own frame, mm; a bottom-side part is the same pattern mirrored in y, then rotated)
BUZ-SMD_L5.0-W5.5-P4.60
  rect 1.7x0.7 smd: 1(-2.3,1.75) 2(-2.3,-1.75) 3(2.3,-1.75)
C0603
  rect 0.8x0.9 smd: 1(-0.7,0) 2(0.7,0)
CONN-SMD_2P-P1.25_DEALON_1.25-2PWB
  rect 0.8x1.801 smd: 1(-0.625,1.275) 2(0.625,1.275)
  rect 1.801x2.901 smd: 3(-3.2,-1.275) 4(3.2,-1.275)
ESOP-8_L4.9-W3.9-P1.27-LS6.0-BL-EP
  rect 0.6x1.2 smd: 1(-1.905,-2.909) 2(-0.635,-2.909) 3(0.635,-2.909) 4(1.905,-2.909) 5(1.905,2.909) 6(0.635,2.909) 7(-0.635,2.909) 8(-1.905,2.909)
  rect 3.3x2.4 smd: 9(0,0)
FPC-SMD_6P-P0.50_XUNPU_FPC-05F-6PH20
  rect 0.3x1.25 smd: 1(-1.25,1.288) 2(-0.75,1.288) 3(-0.25,1.288) 4(0.25,1.288) 5(0.75,1.288) 6(1.25,1.288)
  rect 2x2.5 smd: 7(2.94,-1.288) 8(-2.94,-1.288)
FPC-SMD_24P-P0.50_C5373439
  rect 0.3x1.3 smd: 1(-5.75,1.325) 2(-5.25,1.325) 3(-4.75,1.325) 4(-4.25,1.325) 5(-3.75,1.325) 6(-3.25,1.325) 7(-2.75,1.325) 8(-2.25,1.325) 9(-1.75,1.325) 10(-1.25,1.325) 11(-0.75,1.325) 12(-0.25,1.325) 13(0.25,1.325) 14(0.75,1.325) 15(1.25,1.325) 16(1.75,1.325) 17(2.25,1.325) 18(2.75,1.325) 19(3.25,1.325) 20(3.75,1.325) 21(4.25,1.325) 22(4.75,1.325) 23(5.25,1.325) 24(5.75,1.325)
  rect 1.8x1.4 smd: 25(7.4,-1.325) 26(-7.4,-1.325)
IND-SMD_L2.0-W1.6
  rect 1x1.72 smd: 1(0.828,0) 2(-0.828,0)
IND-SMD_L3.0-W3.0
  rect 1.5x3.32 smd: 1(1.328,0) 2(-1.328,0)
LED0603-RD_RED
  rect 0.8x0.8 smd: 1(-0.799,-0.004) 2(0.799,0.004)
MICRO-USB-SMD_MICRO-XNJ-ZB
  rect 0.4x1.6 smd: 1(1.3,-1.387) 2(0.65,-1.387) 3(0,-1.387) 4(-0.65,-1.387) 5(-1.3,-1.387)
  oval 1x1.6 hole 0.7x1.1: 6(-3.625,1.387) 6(3.625,1.387)
  round 1 hole 0.7: 6(-2.425,-1.262) 6(2.425,-1.262)
R0402
  rect 0.566x0.54 smd: 1(-0.433,0) 2(0.433,0)
R0603
  rect 0.806x0.864 smd: 1(-0.753,0) 2(0.753,0)
SOD-123_L2.7-W1.6-LS3.7-RD-1
  rect 1.2x0.95 smd: 1(-1.7,0) 2(1.7,0)
SOD-123FL_L2.7-W1.8-LS3.7-RD
  rect 1.2x1.15 smd: 1(-1.735,0) 2(1.735,0)
SOD-323_L1.8-W1.3-LS2.5-RD
  rect 1x0.75 smd: 1(-1.173,0) 2(1.173,0)
SOP-8_L4.9-W3.9-P1.27-LS6.0-BL
  oval 0.63x1.865 smd: 1(-1.905,-2.683) 2(-0.635,-2.683) 3(0.635,-2.683) 4(1.905,-2.683) 5(1.905,2.683) 6(0.635,2.683) 7(-0.635,2.683) 8(-1.905,2.683)
SOT-23-3_L2.9-W1.3-P0.95-LS2.4-BR
  rect 1.25x0.7 smd: 1(1,-0.95) 2(1,0.95) 3(-1,0)
SOT-23-3_L2.9-W1.3-P1.90-LS2.4-BR
  rect 1.25x0.7 smd: 1(1,-0.95) 2(1,0.95) 3(-1,0)
SOT-23-5_L3.0-W1.7-P0.95-LS2.8-BR
  rect 1.1x0.6 smd: 1(1.3,-0.95) 2(1.3,0) 3(1.3,0.95) 4(-1.3,0.95) 5(-1.3,-0.95)
SOT-323_L2.0-W1.3-P1.30-LS2.1-BR
  rect 0.9x0.8 smd: 1(0.8,-0.65) 2(0.8,0.65) 3(-0.8,0)
SW-SMD_TS24CA
  rect 0.9x1.2 smd: 1(-2.3,0.775) 2(2.3,0.775)
  rect 1.2x1.3 smd: 3(-1.675,-0.775) 4(1.675,-0.775)
WIRELM-SMD_ESP32-S
  rect 3x1 smd: 1(-9,9.005) 2(-9,7.735) 3(-9,6.465) 4(-9,5.195) 5(-9,3.925) 6(-9,2.655) 7(-9,1.385) 8(-9,0.115) 9(-9,-1.155) 10(-9,-2.425) 11(-9,-3.695) 12(-9,-4.965) 13(-9,-6.235) 14(-9,-7.505) 25(9,-7.505) 26(9,-6.235) 27(9,-4.965) 28(9,-3.695) 29(9,-2.425) 30(9,-1.155) 31(9,0.115) 32(9,1.385) 33(9,2.655) 34(9,3.925) 35(9,5.195) 36(9,6.465) 37(9,7.735) 38(9,9.005)
  rect 1x3 smd: 15(-5.715,-9.005) 16(-4.445,-9.005) 17(-3.175,-9.005) 18(-1.905,-9.005) 19(-0.635,-9.005) 20(0.635,-9.005) 21(1.905,-9.005) 22(3.175,-9.005) 23(4.445,-9.005) 24(5.715,-9.005)
  rect 3.6x3.6 smd: 39(-1.105,1.815)
下载调试点
  round 1 smd far side: 1(0,0.508) 2(0,-1.01) 3(0,-2.54)
电池焊接端子封装2
  custom 5.08x2.413 smd far side: 1(2.54,2.477)

## Nets
3V3: BUZZER1.2 C1.1 C2.2 C8.2 C9.2 C14.1 C21.1 CN1.15 CN1.16 D8.1 ESP32.2 L1.1 L2.1 Q6.1 R1.2 R5.1 R6.2 R11.2 TOUCH.4
GND: C1.2 C2.1 C3.1 C4.1 C5.2 C6.2 C7.1 C8.1 C9.1 C11.1 C12.2 C13.2 C14.2 C15.2 C16.2 C17.2 C18.2 C19.2 C20.2 C21.2 CN1.8 CN1.17 CN1.25 CN1.26 ESP32.1 ESP32.15 ESP32.38 ESP32.39 FPC3.2 FPC3.3 FPC3.4 Q8.2 R4.1 R7.1 R8.1 R9.1 SW1.3 SW2.4 TOUCH.1 TOUCH.8 U2.1 U2.3 U2.9 U9.1 U10.3 U11.2 U13.1 U15.3 USB1.5 USB1.6
VIN: C4.2 C7.2 FPC3.1 U2.5 U8.1 U11.1 U11.4
BEEP: ESP32.23 R10.1
BUSY: CN1.9 ESP32.16
CH_RXD: Q6.2 U10.7
CH_TXD: D7.1 U10.6
CS: CN1.12 ESP32.12
D+: U10.1 USB1.3
D-: U10.2 USB1.2
D/C: CN1.11 ESP32.13
GDR: CN1.2 Q7.1 R8.2
LED_GREEN: LED4.2 U2.6
LED_RED: LED3.2 U2.7
PREVGH: C11.2 CN1.21 U14.1
PREVGL: C19.1 CN1.23 U12.2
RES: CN1.10 ESP32.14
RESE: CN1.3 Q7.2 R9.2
RST: C3.2 ESP32.3 R1.1 SW1.4
RXD: D7.2 ESP32.34 R5.2 U15.2
SCL: ESP32.8 TOUCH.5
SCLK: CN1.13 ESP32.10
SDA: ESP32.9 TOUCH.6
SDI: CN1.14 ESP32.11
T_INT: ESP32.26 TOUCH.2
T_RST: ESP32.29 TOUCH.3
TXD: ESP32.35 Q6.3 U15.1
VCOM: C20.1 CN1.24
VUSB: C6.1 R2.2 R3.2 U2.4 U2.8 U10.5 USB1.1
$1N3910: LED3.1 R2.1
$1N3919: LED4.1 R3.1
$1N3995: R4.2 U2.2
$1N6109: C5.1 U10.8
$1N6898: L1.2 U11.3
$1N7140: R6.1 R7.2 U11.5
$1N8601: C10.1 L2.2 Q7.3 U14.2
$1N8997: C10.2 U12.1 U13.2
$1N10559: C12.1 CN1.4
$1N10610: C13.1 CN1.5
$1N10807: C15.1 CN1.18
$1N10858: C16.1 CN1.19
$1N10911: C17.1 CN1.20
$1N10977: C18.1 CN1.22
$1N13203: BUZZER1.3 D8.2 Q8.3
$1N13207: Q8.1 R10.2
$1N14870: ESP32.25 R11.1 SW2.3

Pads without a net: BUZZER1 1; CN1 1 6 7; ESP32 4 5 6 7 17 18 19 20 21 22 24 27 28 30 31 32 33 36 37; SW1 1 2; SW2 1 2; TOUCH 7; U10 4; USB1 4

## Via types
v1: diameter 0.61, hole 0.305, Top Layer to Bottom Layer, 57 vias

## Routing (per net, layer and track width the routed paths; a pad name or vN(x,y) marks a point on that pad's centre or on a via; arc(x,y) is an arc through that point)
3V3: length 170.9
  Top Layer w0.254: R11.2 33.68,12.67 R1.2 33.01,23.6 33.01,22.5 32.35,21.84 32.1,21.84 29.36,24.57 29.36,26.71 29.09,26.98 28.1,26.98 28,27.08 ; Q6.1 17.07,24.46 18.89,24.46 20.33,23.02 R5.1 20.95,23.21 20.95,26.07 20.03,26.99 18.22,26.99 18.22,27.93 18.8,28.51 22.83,28.51 23.31,28.99 23.31,31.23 23.13,31.41 22.34,31.41 C8.2 ; TOUCH.4 4.71,14.9 3.65,13.83 v1(3.65,12.24)
  Top Layer w0.381: 18.93,13.46 18.93,11.78 v1(19.28,11.43) ; v1(19.28,11.43) 19.06,11.22 19.06,6.77 18.23,5.94 15.36,5.94 14.81,5.39 14.81,4.22 C14.1 ; v1(19.28,11.43) 19.43,11.59 19.43,13.46
  Top Layer w0.508: 23.44,32.05 23.93,31.55 23.93,27.89 23.57,27.53 22.37,27.53 21.69,26.85 21.69,20.93 19.86,19.1 10.42,19.1 9,17.67 9,16.82 9.78,16.03 9.81,16.03 C9.2 10.4,13.15 9.49,12.24 v1(3.65,12.24) ; 23.44,32.05 22.58,32.05 22.21,32.41 ; 23.44,32.05 23.46,32.05 ; 22.21,32.41 22.4,32.6 22.4,33.46 21.16,34.7 ; 22.21,32.41 C8.2 ; 28,27.41 28,21.72 27.9,21.62 L2.1 ; 23.46,32.05 23.48,32.05 28.12,27.41 ; 23.46,32.05 23.46,34.37 23.82,34.73 24.38,34.73 D8.1 24.39,33.84 25.52,32.71 v1(25.52,32.06)
  Bottom Layer w0.381: v1(25.52,32.06) 29.59,32.06 BUZZER1.2 30.91,29.97 C21.1 28.28,27.34 25.55,27.34 23.73,25.52 23.73,15.89 v1(19.28,11.43)
  Bottom Layer w0.508: v1(3.65,12.24) 2.54,11.13 C1.1 C2.2 7.93,9.45 ESP32.2
GND: length 40.1
  Top Layer w0.254: v1(19.89,8.73) 19.89,13.42 19.93,13.46 ; 10.23,10.78 10.23,10.63 8.78,9.18 8.78,4.38 C12.2 C13.2 C14.2 C15.2 C16.2 C17.2 C18.2 C19.2 C20.2 29.81,2.65 32.28,5.12 SW2.4 ; v1(15.54,14.5) 15.43,14.39 15.43,13.46
  vias: v1(1.35,18.87) v1(1.38,25.8) v1(3.41,25.8) v1(3.41,18.87) v1(5.62,10.77) v1(7.9,26.02) v1(10.01,27.52) v1(10.69,8.3) v1(14.42,17.92) v1(14.72,19.86) v1(15.1,24.26) v1(17.73,17.54) v1(19.73,29.12) v1(20.19,24.22) v1(20.31,36.93) v1(21.62,36.93) v1(22.88,36.94) v1(24.1,36.93) v1(25.49,36.93) v1(26.72,29.93) v1(28.79,10.79) v1(28.79,9.56) v1(29.65,18.18) v1(29.65,17.13) v1(29.65,16.08) v1(29.65,15.04) v1(30.1,10.78) v1(33.77,27.58)
VIN: length 27.6
  Top Layer w0.254: U11.1 19.91,29.88 19.22,29.88 19.04,30.06 19.04,31.2 18.42,31.82 U11.4
  Top Layer w0.508: C4.2 12.8,36.51 v1(13.88,36.51) 15.13,35.26 C7.2 17.1,31.57 U11.4 ; v1(12.79,33.15) 12.79,32.16 U2.5
  Bottom Layer w0.508: v1(12.79,33.15) 12.94,33.3 FPC3.1 ; v1(13.88,36.51) 14.25,36.13 FPC3.1 ; FPC3.1 15.84,33.3 16.93,34.39 U8.1
BEEP: length 6.6
  Bottom Layer w0.254: R10.1 21.62,28.44 21.49,28.31 21.49,26.33 ESP32.23
BUSY: length 17.5
  Top Layer w0.254: 15.93,13.46 15.93,12.65 15.46,12.18 v1(14.78,12.18)
  Bottom Layer w0.254: v1(14.78,12.18) 14.29,12.18 13.61,12.86 13.61,22.67 12.62,23.66 ESP32.16
CH_RXD: length 5.9
  Top Layer w0.254: 8.42,22.96 12.87,22.96 13.29,23.39 14.1,23.39 Q6.2
CH_TXD: length 12.8
  Top Layer w0.254: 18.18,23.53 17.28,23.53 16.98,23.23 16.98,21.04 16.42,20.48 14.15,20.48 12.94,21.69 U10.6
CS: length 23
  Top Layer w0.254: v1(15.66,9.85) 17.43,11.62 17.43,13.46
  Bottom Layer w0.254: v1(15.66,9.85) 13.82,9.85 12.15,11.52 12.15,21.67 11.54,22.28 ESP32.12
D+: length 13.8
  Top Layer w0.254: U10.1 4.24,24.23 4.68,23.8 4.93,23.8 5.11,23.98 5.11,25.75 7.14,27.78 7.14,28.75 arc(7.07,28.93) 6.89,29 6.81,29 arc(6.56,29.26) 6.81,29.51 6.89,29.51 arc(7.14,29.77) 6.89,30.02 6.86,30.02 arc(6.61,30.27) 6.86,30.53 6.89,30.53 arc(7.07,30.6) 7.14,30.78 7.14,31.27 6.96,31.45 6.71,31.45 6.58,31.33 USB1.3
D-: length 13.8
  Top Layer w0.254: USB1.2 7.01,31.98 7.55,31.44 7.55,27.61 5.52,25.58 5.52,23.81 5.1,23.39 4.68,23.39 4.24,22.96 3.06,22.96
D/C: length 22.2
  Top Layer w0.254: 16.93,13.46 16.93,11.83 15.82,10.72 v1(15.66,10.72)
  Bottom Layer w0.254: ESP32.13 10.94,23.55 12.64,21.85 12.64,11.79 13.71,10.72 v1(15.66,10.72)
GDR: length 16.4
  Top Layer w0.254: 12.43,13.46 12.47,13.49 R8.2 13.15,15.38 13.38,15.62 13.38,18.25 13.63,18.5 20.02,18.5 22.62,21.11 Q7.1
LED_GREEN: length 5.4
  Top Layer w0.254: v1(11.54,33.22) 11.53,33.21 U2.6
  Bottom Layer w0.254: LED4.2 10.27,33.71 10.76,33.22 v1(11.54,33.22)
LED_RED: length 8.8
  Top Layer w0.254: 10.26,32.15 10.26,32.99 9.87,33.39 v1(9.77,33.39)
  Bottom Layer w0.254: v1(9.77,33.39) 8.03,33.39 5.86,35.56 4.57,35.56 4.11,36.02 4.11,36.61
PREVGH: length 9.1
  Top Layer w0.254: 21.93,13.46 21.93,14.25 22.39,14.71 22.39,15.53 21.38,14.52 16.94,14.52 16.76,14.7 16.76,15.39 C11.2
PREVGL: length 16.9
  Top Layer w0.254: 27.31,15.53 27.31,14.8 27,14.49 23.27,14.49 22.93,14.15 22.93,13.46 ; 22.93,13.46 22.93,7.18 26.06,4.05 C19.1
RES: length 20.9
  Top Layer w0.254: 16.43,13.46 16.43,12.27 v1(15.65,11.49)
  Bottom Layer w0.254: v1(15.65,11.49) 14.24,11.49 13.08,12.65 13.08,22.08 10.34,24.82 ESP32.14
RESE: length 16.1
  Top Layer w0.254: Q7.2 22.5,20.12 22.14,20.12 20.14,18.12 15.64,18.12 15.46,17.94 15.46,15.58 15.28,15.4 14.45,15.4 R9.2 13.54,14.49 13.27,14.49 12.93,14.15 12.93,13.46
RST: length 46.4
  Top Layer w0.254: 32.28,29.21 32.28,26.48 C3.2 32.23,24.33 R1.1 32.18,24.27 v1(32.18,22.83) ; v1(33.04,21.33) 32.82,21.11 v1(32.82,18.38)
  Bottom Layer w0.254: ESP32.3 9.74,10.85 13.19,7.4 28.75,7.4 32.66,11.31 32.72,11.31 33.18,11.77 33.18,18.03 v1(32.82,18.38) ; v1(33.04,21.33) 33.04,21.97 v1(32.18,22.83)
RXD: length 30.2
  Top Layer w0.254: 18.18,20.15 19.39,20.15 R5.2 19.5,21.92 v1(19.33,21.92)
  Bottom Layer w0.254: v1(19.33,21.92) 19.33,12.31 18.69,11.68 18.69,11.19 19.33,10.55 19.5,10.55 22.34,13.39 ESP32.34 27.94,13.39 28.2,13.65 32.36,13.65 32.4,13.61
SCL: length 4.6
  Top Layer w0.254: v1(5.6,15.75) 5.6,15.96 5.28,16.27 5.28,16.94 TOUCH.5
  Bottom Layer w0.254: v1(5.6,15.75) 6.28,16.43 6.28,16.54 6.94,17.2 ESP32.8
SCLK: length 24.1
  Top Layer w0.254: 17.93,13.46 17.93,10.41 v1(15.66,8.14)
  Bottom Layer w0.254: ESP32.10 10.89,19.74 11.13,19.5 11.13,10.25 13.24,8.14 v1(15.66,8.14)
SDA: length 3.6
  Top Layer w0.254: v1(6.06,18.42) 5.71,18.07 TOUCH.6
  Bottom Layer w0.254: v1(6.06,18.42) 8.01,18.42 ESP32.9
SDI: length 25.1
  Top Layer w0.254: 18.43,13.46 18.43,9.57 v1(17.81,8.95)
  Bottom Layer w0.254: ESP32.11 11.36,21.01 11.65,20.72 11.65,11.26 13.96,8.95 v1(17.81,8.95)
T_INT: length 66
  Top Layer w0.254: v1(3.56,15.71) 3.71,15.86 TOUCH.2
  Bottom Layer w0.254: ESP32.26 29.94,23.55 34.17,19.32 34.17,10.88 29.66,6.37 1.7,6.37 0.82,7.25 0.82,14.98 1.54,15.71 v1(3.56,15.71)
T_RST: length 61.7
  Top Layer w0.254: TOUCH.3 4.21,15.22 v1(4.1,15.11)
  Bottom Layer w0.254: v1(4.1,15.11) 1.79,15.11 1.44,14.76 1.44,7.57 2.1,6.91 29.18,6.91 33.67,11.4 33.67,18.79 32.72,19.74 ESP32.29
TXD: length 28.7
  Top Layer w0.254: v1(16.1,21.42) Q6.3
  Bottom Layer w0.254: U15.1 32.37,12.12 ESP32.35 21.74,12.12 19.59,9.97 19.34,9.97 17.69,11.61 17.69,11.87 18.77,12.94 18.77,18.75 v1(16.1,21.42)
VCOM: length 12.4
  Top Layer w0.254: C20.1 27.41,4.05 26.73,4.73 26.15,4.73 23.43,7.45 23.43,13.46
VUSB: length 38
  Top Layer w0.254: USB1.1 8.51,32.63 U2.8
  Top Layer w0.508: 8.84,30.61 8.84,31.29 8.96,31.41 8.96,32.11 U2.8 9,34.58 R3.2 R2.2 ; 8.84,30.61 8.84,27.87 8.89,27.82 8.89,27.58 8.65,27.34 8.13,27.34 6.57,25.78 6.57,20.02 6.93,19.66 9.84,19.66 C6.1 8.45,20.45 U10.5 ; 8.84,30.61 9.08,30.84 9.12,30.84 9.32,31.05 12.97,31.05 13.33,30.69 13.33,27.57 12.81,27.04 U2.4
$1N3910: length 1.8
  Top Layer w0.254: R2.1 v1(6.51,36.6)
  Bottom Layer w0.254: v1(6.51,36.6) 5.71,36.6 LED3.1
$1N3919: length 2.7
  Top Layer w0.254: R3.1 7.51,35.39 v1(7.77,35.66)
  Bottom Layer w0.254: v1(7.77,35.66) 8.01,35.9 8.34,35.9 8.67,36.23 LED4.1
$1N3995: length 15.5
  Top Layer w0.254: R4.2 12.12,33.74 13.26,33.74 13.91,33.09 13.91,25.5 13.68,25.27 10.51,25.27 10.33,25.45 10.33,26.26 10.26,26.33
$1N6109: length 2.2
  Top Layer w0.254: U10.8 10.6,24.23 C5.1
$1N6898: length 4
  Top Layer w0.508: U11.3 19.95,32.55 19.66,32.84 18.79,32.84 18.46,33.17 18.46,34.7
$1N7140: length 4.7
  Top Layer w0.254: R7.2 17.36,25.36 R6.1 17.35,27 U11.5
$1N8601: length 13.7
  Top Layer w0.254: 23.27,23.15 25.85,23.15 ; 25.85,23.15 24.79,22.09 24.79,20.97 24.58,20.76 24.22,20.76 22.39,18.93 21.78,18.93 20.39,17.54 19.13,17.54 18.78,17.18 C10.1 ; 25.85,23.15 25.98,23.28 L2.2
$1N8997: length 10
  Top Layer w0.254: C10.2 20.09,15.44 21.93,17.28 23.2,17.28 24.85,18.93 27.31,18.93
$1N10559: length 10.8
  Top Layer w0.254: 13.43,13.46 13.43,6.67 10.81,4.05 C12.1
$1N10610: length 9.9
  Top Layer w0.254: C13.1 12.75,5.15 13.93,6.34 13.93,13.46
$1N10807: length 10.8
  Top Layer w0.254: C15.1 17.3,4.05 20.5,7.25 20.5,13.39 20.43,13.46
$1N10858: length 10
  Top Layer w0.254: 20.93,13.46 20.93,6.94 19.46,5.46 C16.1
$1N10911: length 9.5
  Top Layer w0.254: C17.1 21.69,4.66 21.43,4.92 21.43,13.46
$1N10977: length 10
  Top Layer w0.254: C18.1 23.93,5.39 22.43,6.89 22.43,13.46
$1N13203: length 6.5
  Top Layer w0.254: Q8.3 27.98,34.72 D8.2 26.91,34.54 26.91,31.86 v1(26.45,31.4)
  Bottom Layer w0.254: BUZZER1.3 26.45,30.87 v1(26.45,31.4)
$1N13207: length 3.5
  Top Layer w0.254: v1(27.72,29.91) 27.72,31.88 27.71,31.89
  Bottom Layer w0.254: v1(27.72,29.91) 27.72,28.56 R10.2
$1N14870: length 18.4
  Top Layer w0.254: 32.29,10.48 R11.1 32.29,16.99 28.71,20.57 v1(28.71,24.78)
  Bottom Layer w0.254: v1(28.71,24.78) 28.67,24.82 ESP32.25

## Copper pours and planes (outline as drawn; the poured copper is in the pictures)
GND on Top Layer: -0.93,39.22 37.02,39.22 37.02,-0.98 -0.93,-0.98
GND on Bottom Layer: -0.85,39.14 36.51,39.14 36.51,-0.82 -0.85,-0.82
VUSB on Top Layer: 4.83,32.83 9.3,32.83 9.3,31.54 4.83,31.54

Small or netless copper shapes (teardrops, artwork), in the pictures only: 151 on Top Layer, 64 on Bottom Layer

## Text on the board
Top Silkscreen Layer: 桌面小屏幕 / 22009101510 / 赵怀潼
